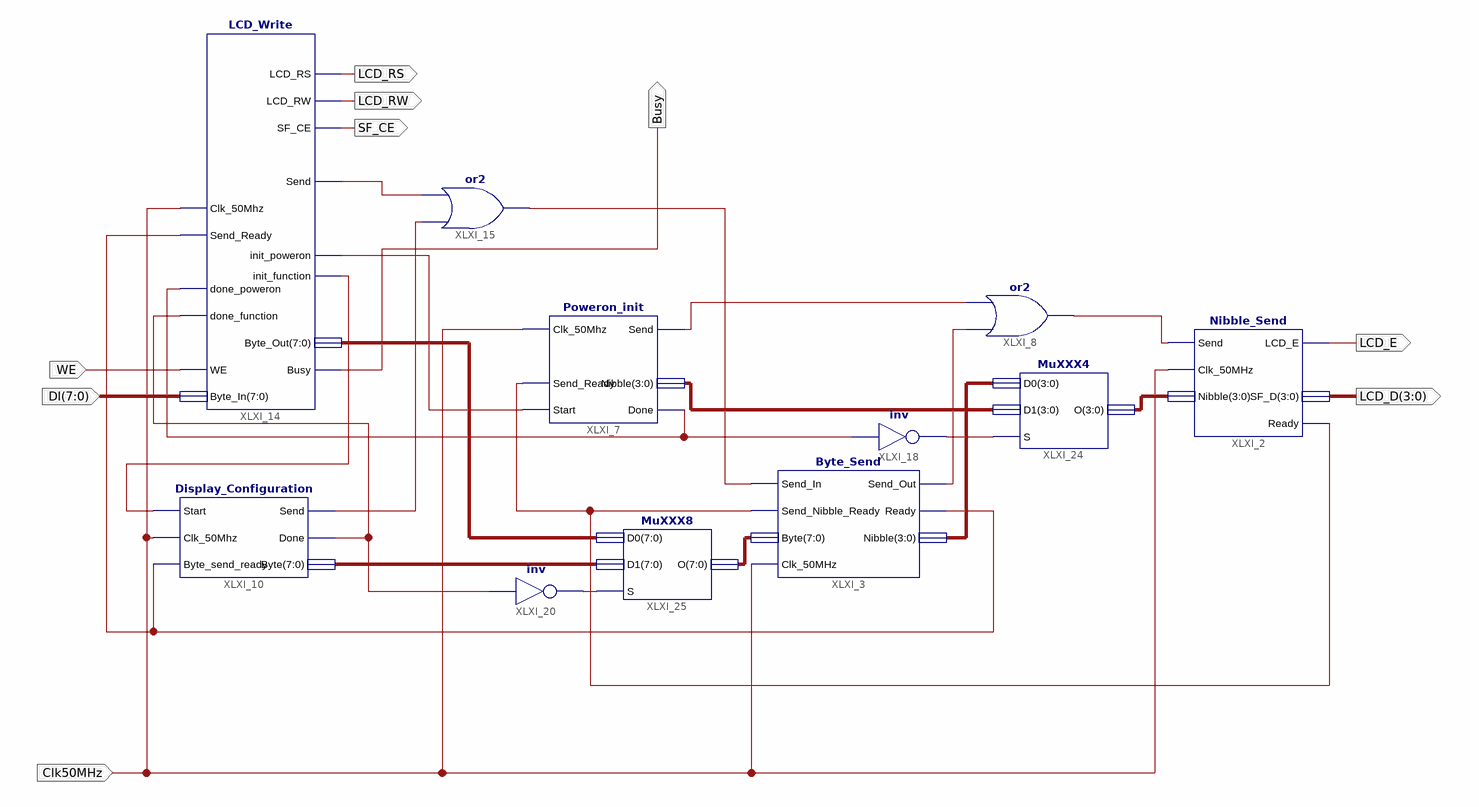
[diagram p0: schematic sheet 1]
// Xilinx ISE schematic test_LCD.sch (spartan3e) as structural Verilog: 11 symbols, 9 ports
module test_LCD (
  input  Clk50MHz,
  input  [7:0] DI,
  input  WE,
  output LCD_RS,
  output LCD_RW,
  output SF_CE,
  output LCD_E,
  output [3:0] LCD_D,
  output Busy
);

  wire Clk_50MHz, XLXN_21, XLXN_24, XLXN_51, XLXN_52, XLXN_53, XLXN_59, XLXN_60, XLXN_61, XLXN_99, XLXN_122,
       XLXN_124, XLXN_127, XLXN_130;
  wire [3:0] XLXN_68, XLXN_103, XLXN_129;
  wire [7:0] XLXN_106, XLXN_109, XLXN_110;

  Byte_Send XLXI_3 (
    .Clk_50MHz(Clk50MHz), .Send_In(XLXN_61), .Send_Nibble_Ready(Clk_50MHz), .Byte(XLXN_106),
    .Send_Out(XLXN_99), .Ready(XLXN_124), .Nibble(XLXN_103));
  Poweron_init XLXI_7 (
    .Clk_50Mhz(Clk50MHz), .Start(XLXN_51), .Send_Ready(Clk_50MHz), .Send(XLXN_21), .Done(XLXN_52),
    .Nibble(XLXN_68));
  or XLXI_8 (XLXN_24, XLXN_99, XLXN_21);
  Display_Configuration XLXI_10 (
    .Start(XLXN_122), .Clk_50Mhz(Clk50MHz), .Byte_send_ready(XLXN_124), .Send(XLXN_60), .Done(XLXN_53),
    .Byte(XLXN_109));
  LCD_Write XLXI_14 (
    .Clk_50Mhz(Clk50MHz), .Send_Ready(XLXN_124), .done_poweron(XLXN_52), .done_function(XLXN_53), .WE(WE),
    .Byte_In(DI), .Send(XLXN_59), .LCD_RS(LCD_RS), .LCD_RW(LCD_RW), .SF_CE(SF_CE), .init_poweron(XLXN_51),
    .init_function(XLXN_122), .Busy(Busy), .Byte_Out(XLXN_110));
  or XLXI_15 (XLXN_61, XLXN_60, XLXN_59);
  not XLXI_18 (XLXN_127, XLXN_52);
  Nibble_Send XLXI_2 (
    .Send(XLXN_24), .Clk_50MHz(Clk50MHz), .Nibble(XLXN_129), .LCD_E(LCD_E), .Ready(Clk_50MHz), .SF_D(LCD_D));
  not XLXI_20 (XLXN_130, XLXN_53);
  MuXXX4 XLXI_24 (.O(XLXN_129), .D0(XLXN_103), .D1(XLXN_68), .S(XLXN_127));
  MuXXX8 XLXI_25 (.D0(XLXN_110), .D1(XLXN_109), .S(XLXN_130), .O(XLXN_106));
endmodule
